# EAGLE design chassis_ctrl (EAGLE 9.6.2)
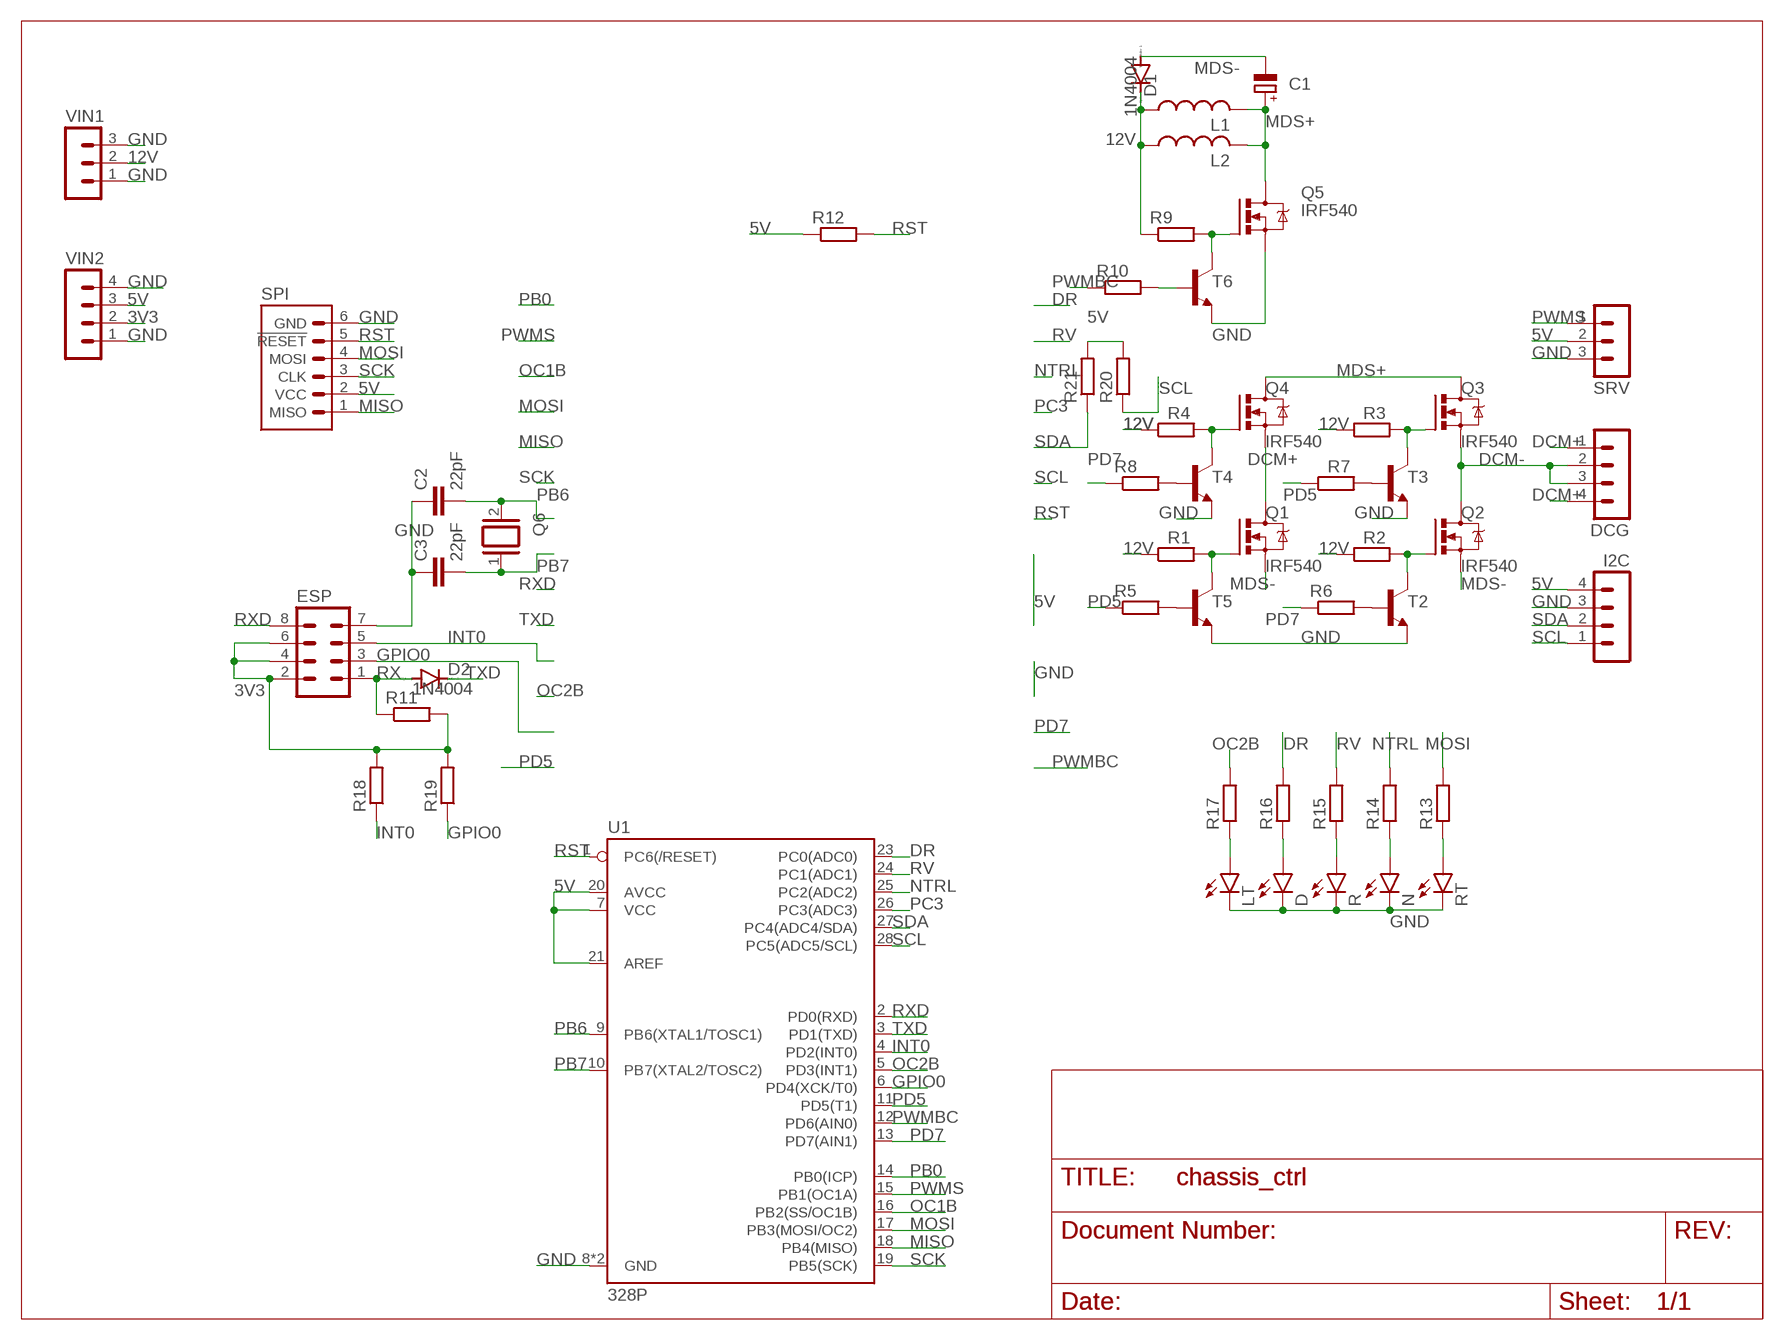
[diagram p0: schematic, sheet 1]

## Parts
C1  CPOL-EUE5-10.5  [E5-10,5]
C2  22pF  22PF-PTH-2.54MM-200V-5%  [CAP-PTH-2.54]
C3  22pF  22PF-PTH-2.54MM-200V-5%  [CAP-PTH-2.54]
D  LED5MM  [LED5MM]
D1  1N4004  [DO41-10]
D2  1N4004  [DO41-10]
DCG  MA04-1  [MA04-1]
ESP  MA04-2  [MA04-2]
I2C  MA04-1  [MA04-1]
L1  L-US0204V  [0204V]
L2  L-US0204V  [0204V]
LT  LED5MM  [LED5MM]
N  LED5MM  [LED5MM]
Q1  IRF540  [TO220BV]
Q2  IRF540  [TO220BV]
Q3  IRF540  [TO220BV]
Q4  IRF540  [TO220BV]
Q5  IRF540  [TO220BV]
Q6  XTAL/S  [QS]
R  LED5MM  [LED5MM]
R1  R-EU_0207/10  [0207/10]
R2  R-EU_0207/10  [0207/10]
R3  R-EU_0207/10  [0207/10]
R4  R-EU_0207/10  [0207/10]
R5  R-EU_0207/10  [0207/10]
R6  R-EU_0207/10  [0207/10]
R7  R-EU_0207/10  [0207/10]
R8  R-EU_0207/10  [0207/10]
R9  R-EU_0207/10  [0207/10]
R10  R-EU_0207/10  [0207/10]
R11  R-EU_0207/10  [0207/10]
R12  R-EU_0207/10  [0207/10]
R13  R-EU_0207/10  [0207/10]
R14  R-EU_0207/10  [0207/10]
R15  R-EU_0207/10  [0207/10]
R16  R-EU_0207/10  [0207/10]
R17  R-EU_0207/10  [0207/10]
R18  R-EU_0207/10  [0207/10]
R19  R-EU_0207/10  [0207/10]
R20  R-EU_0207/10  [0207/10]
R21  R-EU_0207/10  [0207/10]
RT  LED5MM  [LED5MM]
SPI  MISO_MOSITHT_100MIL  [PINHEADER_2R03_100MIL]
SRV  MA03-1  [MA03-1]
T2  2N2222-NPN-TO92-EBC  [TO92-EBC]
T3  2N2222-NPN-TO92-EBC  [TO92-EBC]
T4  2N2222-NPN-TO92-EBC  [TO92-EBC]
T5  2N2222-NPN-TO92-EBC  [TO92-EBC]
T6  2N2222-NPN-TO92-EBC  [TO92-EBC]
U1  328P  ATMEGA328P_PDIP  [DIP28]
VIN1  MA03-1  [MA03-1]
VIN2  MA04-1  [MA04-1]

## Nets
3V3: ESP.2 ESP.4 ESP.6 R11.2 R18.2 R19.2 VIN2.2
5V: I2C.4 R12.1 R20.2 R21.2 SPI.2(VCC) SRV.2 U1.7(VCC) U1.20(AVCC) U1.21(AREF) VIN2.3
12V: D1.C L1.1 L2.1 R1.1 R2.1 R3.1 R4.1 R9.1 VIN1.2
DCM+: DCG.1 DCG.4 Q1.D Q4.S
DCM-: DCG.2 DCG.3 Q2.D Q3.S
DR: R16.2 U1.23(PC0(ADC0))
GND: C2.1 C3.1 D.K(C) ESP.7 I2C.3 LT.K(C) N.K(C) Q5.S R.K(C) RT.K(C) SPI.6(GND) SRV.3 T2.E T3.E T4.E T5.E T6.E U1.8(GND) U1.22(GND) VIN1.1 VIN1.3 VIN2.1 VIN2.4
GPIO0: ESP.3 R19.1 U1.6(PD4(XCK/T0))
INT0: ESP.5 R18.1 U1.4(PD2(INT0))
MDS+: C1.+ L1.2 L2.2 Q3.D Q4.D Q5.D
MDS-: C1.- D1.A Q1.S Q2.S
MISO: SPI.1(MISO) U1.18(PB4(MISO))
MOSI: R13.2 SPI.4(MOSI) U1.17(PB3(MOSI/OC2))
N$1: LT.A R17.1
N$2: D.A R16.1
N$3: R15.1 R.A
N$4: N.A R14.1
N$5: R13.1 RT.A
N$6: Q2.G R2.2 T2.C
N$7: Q1.G R1.2 T5.C
N$8: Q3.G R3.2 T3.C
N$9: Q4.G R4.2 T4.C
N$10: R5.2 T5.B
N$11: R7.2 T3.B
N$12: R6.2 T2.B
N$13: R8.2 T4.B
N$16: Q5.G R9.2 T6.C
N$18: R10.2 T6.B
NTRL: R14.2 U1.25(PC2(ADC2))
OC1B: U1.16(PB2(SS/OC1B))
OC2B: R17.2 U1.5(PD3(INT1))
PB0: U1.14(PB0(ICP))
PB6: C2.2 Q6.2 U1.9(PB6(XTAL1/TOSC1))
PB7: C3.2 Q6.1 U1.10(PB7(XTAL2/TOSC2))
PC3: U1.26(PC3(ADC3))
PD5: R5.1 R7.1 U1.11(PD5(T1))
PD7: R6.1 R8.1 U1.13(PD7(AIN1))
PWMBC: R10.1 U1.12(PD6(AIN0))
PWMS: SRV.1 U1.15(PB1(OC1A))
RST: R12.2 SPI.5(!RESET) U1.1(PC6(/RESET))
RV: R15.2 U1.24(PC1(ADC1))
RX: D2.A ESP.1 R11.1
RXD: ESP.8 U1.2(PD0(RXD))
SCK: SPI.3(CLK) U1.19(PB5(SCK))
SCL: I2C.1 R20.1 U1.28(PC5(ADC5/SCL))
SDA: I2C.2 R21.1 U1.27(PC4(ADC4/SDA))
TXD: D2.C U1.3(PD1(TXD))

## Library data of the parts
C1 = rcl:CPOL-EU: POLARIZED CAPACITOR, European symbol; SPICEPREFIX: C
C2 C3 = SparkFun-Capacitors:22PF: 22pF ceramic capacitors A capacitor is a passive two-terminal electrical component used to store electrical energy temporarily in an electric field.; PROD_ID: CAP-09128
D LT N R RT = led:LED: LED OSRAM: - CHIPLED LG R971, LG N971, LY N971, LG Q971, LY Q971, LO R971, LY R971 LH N974, LH R974 LS Q976, LO Q976, LY Q976 LO Q996 - Hyper CHIPLED LW Q18S LB Q993, LB Q99A, LB R99A - SideLED LS A670, LO A670, LY A670, LG A670, LP A670 LB A673, LV A673, LT A673, LW A673 LH A674 LY A675 LS A676, LA A676, LO A676, LY A676, LW A676 LS A679, LY A679, LG A679 - Hyper Micro SIDELED® LS Y876, LA Y876, LO Y876, LY Y876 LT Y87S - SmartLED LW L88C, LW L88S LB L89C, LB L89S, LG L890 LS L89K, LO L89K, LY L89K LS L896, LA L896, LO L896, LY L896 - TOPLED LS T670, LO T670, LY T670, LG T670, LP T670 LSG T670, LSP T670, LSY T670, LOP T670, LYG T670 LG T671, LOG T671, LSG T671 LB T673, LV T673, LT T673, LW T673 LH T674 LS T676, LA T676, LO T676, LY T676, LB T676, LH T676, LSB T676, LW T676 LB T67C, LV T67C, LT T67C, LS T67K, LO T67K, LY T67K, LW E67C LS E67B, LA E67B, LO E67B, LY E67B, LB E67C, LV E67C, LT E67C LW T67C LS T679, LY T679, LG T679 LS T770, LO T770, LY T770, LG T770, LP T770 LB T773, LV T773, LT T773, LW T773 LH T774 LS E675, LA E675, LY E675, LS T675 LS T776, LA T776, LO T776, LY T776, LB T776 LHGB T686 LT T68C, LB T68C - Hyper Mini TOPLED® LB M676 - Mini TOPLED Santana® LG M470 LS M47K, LO M47K, LY M47K Source: http://www.osram.convergy.de LUXEON: - LUMILED® LXK2-PW12-R00, LXK2-PW12-S00, LXK2-PW14-U00, LXK2-PW14-V00 LXK2-PM12-R00, LXK2-PM12-S00, LXK2-PM14-U00 LXK2-PE12-Q00, LXK2-PE12-R00, LXK2-PE12-S00, LXK2-PE14-T00, LXK2-PE14-U00 LXK2-PB12-K00, LXK2-PB12-L00, LXK2-PB12-M00, LXK2-PB14-N00, LXK2-PB14-P00, LXK2-PB14-Q00 LXK2-PR12-L00, LXK2-PR12-M00, LXK2-PR14-Q00, LXK2-PR14-R00 LXK2-PD12-Q00, LXK2-PD12-R00, LXK2-PD12-S00 LXK2-PH12-R00, LXK2-PH12-S00 LXK2-PL12-P00, LXK2-PL12-Q00, LXK2-PL12-R00 Source: www.luxeon.com KINGBRIGHT: KA-3528ASYC Source: www.kingbright.com
D1 D2 = diode:1N4004: DIODE general purpose rectifier, 1 A
DCG I2C VIN2 = con-lstb:MA04-1: PIN HEADER; OC_FARNELL: unknown; OC_NEWARK: unknown
ESP = con-lstb:MA04-2: PIN HEADER; OC_FARNELL: unknown; OC_NEWARK: unknown
L1 L2 = rcl:L-US: INDUCTOR, American symbol; SPICEPREFIX: L
Q1-Q5 = transistor-power:IRF540: HEXFET Power MOSFET
Q6 = special:XTAL/S: CRYSTAL
R1-R21 = rcl:R-EU_: RESISTOR, European symbol; SPICEPREFIX: R
SPI = atmel:MISO_MOSI: MISO/MOSI Programmer Interface refere to Atmel/Microchip description of pin header style <http://microchipdeveloper.com/atmelice:connecting-atmel-ice-to-a-debugwire-target>; OC_FARNELL: unknown; OC_NEWARK: unknown
SRV VIN1 = con-lstb:MA03-1: PIN HEADER; OC_FARNELL: unknown; OC_NEWARK: unknown
T2-T6 = transistor-neu-to92:*-NPN-: NPN Transistror
U1 = SparkFun-IC-Microcontroller:ATMEGA328P_PDIP: Atmel 328P Through hole ATMEGA328P uC used in the Arduino 32kb flash, 1k EEPROM, 2k SRAM Datasheet <http://www.sparkfun.com/datasheets/Components/SMD/ATMega328.pdf> SparkFun Products Storefront component: AVR 28 Pin 20MHz 32K 6A/D - ATMega328P <https://www.sparkfun.com/products/9061> (COM-09061) SparkFun Simon Says - Through-Hole Soldering Kit <https://www.sparkfun.com/products/10547> (KIT-10547) SparkFun Learn to Solder - Simon Says <https://www.sparkfun.com/products/13708> (KIT-13708) SparkFun BigTime Watch Kit <https://www.sparkfun.com/products/11734> (KIT-11734) SparkFun ClockIt <https://www.sparkfun.com/products/10930> (KIT-10930) SparkFun Serial Enabled LCD Kit <https://www.sparkfun.com/products/10097> (LCD-10097) SparkFun Simon Tilts - Through Hole Soldering Kit <https://www.sparkfun.com/products/12634> (KIT-12634) SparkFun Frequency Counter Kit <https://www.sparkfun.com/products/10140> (KIT-10140) FabFM Radio Kit <https://www.sparkfun.com/products/11043> (KIT-11043) SparkFun Binary Blaster Kit <https://www.sparkfun.com/products/12037> (KIT-12037) SparkFun Metro-Gnome <https://www.sparkfun.com/products/9236> (KIT-09236) ATmega328 with Arduino Optiboot (Uno) <https://www.sparkfun.com/products/10524> (DEV-10524); PROD_ID: IC-09136

## Board
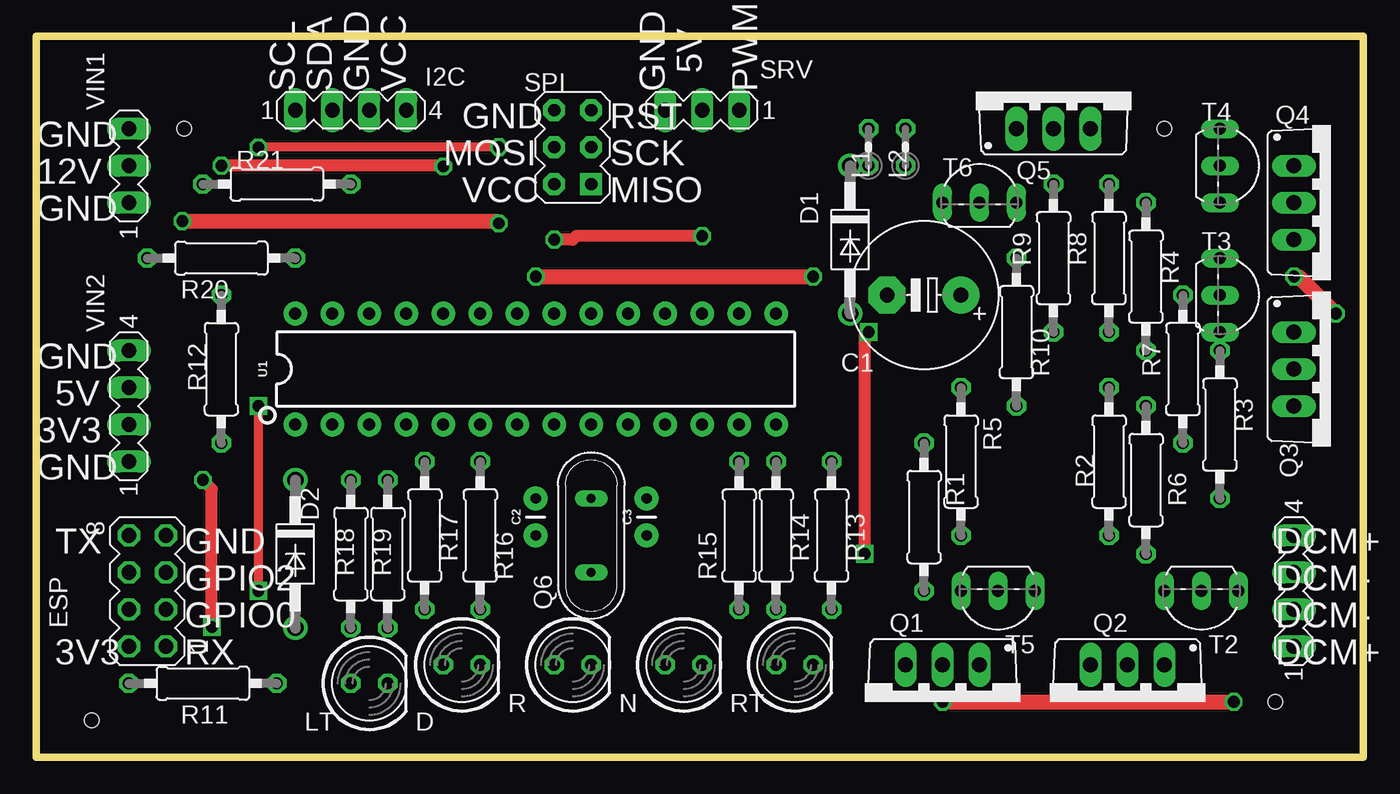
[diagram p1: board, top side]
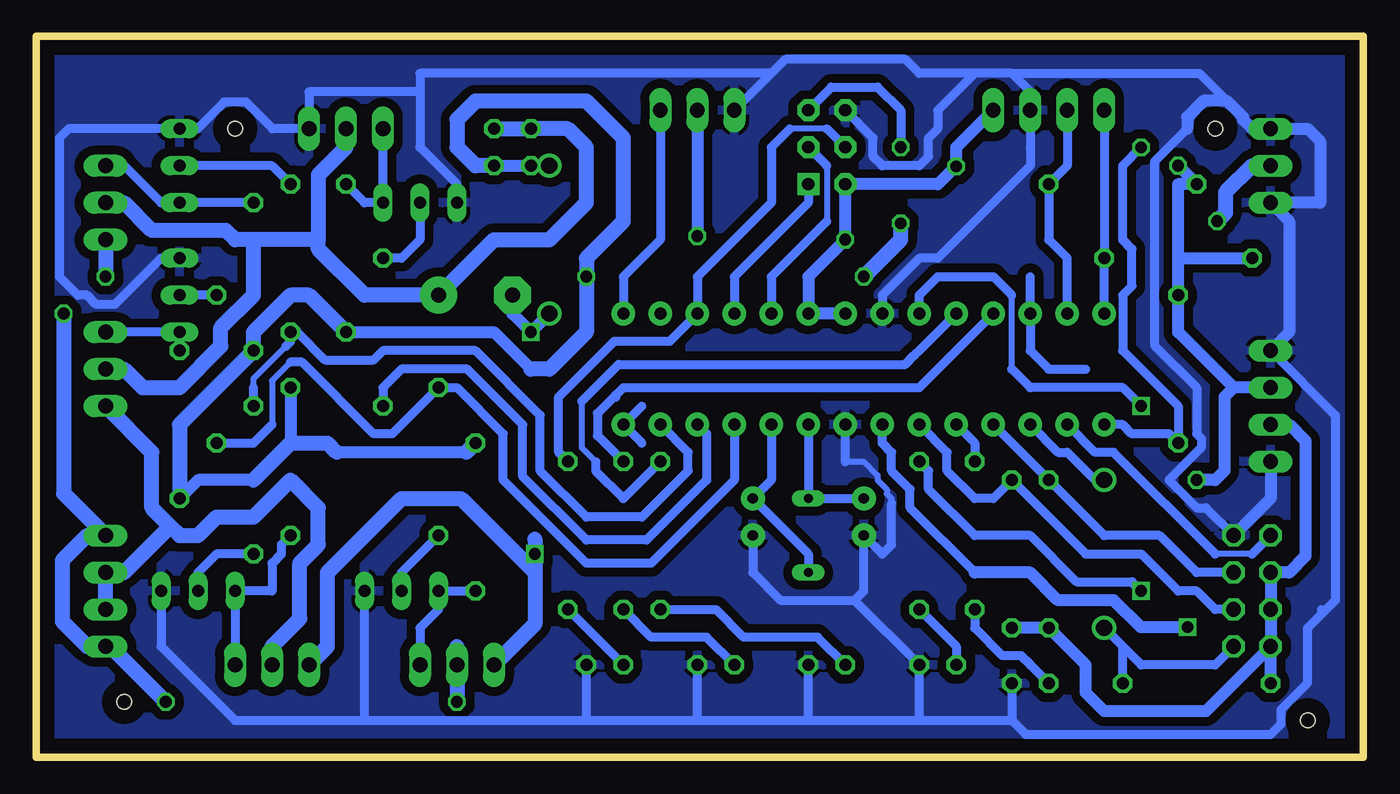
[diagram p2: board, bottom side, seen from below]

Size 91.11 x 49.52 mm. Coordinates in mm from the lower left corner, seen from the top.
Outline: 0,0 91.11,0 91.11,49.52 0,49.52 0,0
Copper layers (1*16): Top 0.035mm / dielectric 1.5mm / Bottom 0.035mm
Design rules "default": minimum track width 6mil, minimum drill 0.35mm, track to track 6mil, track to pad 6mil, pad to pad 6mil, via to via 6mil, smd to smd 6mil, copper to edge 40mil, drill to drill 6mil, minimum pad ring 10mil, minimum via ring 8mil, stop-mask expansion 4mil, vias tented up to drill 0mil, thermal gap 10mil
Holes 1 mm at 85.09,3.81 10.16,43.18 3.81,2.54 77.47,43.18

### Footprints (pad centres in the part's own frame; a part is rotated, then mirrored left to right if it is on the bottom)
E5-10,5 = drill 1.016 pad 2.54: + -2.54,0 | drill 1.016 pad 2.54 octagon: - 2.54,0
CAP-PTH-2.54 = drill 0.7 pad 1.651: 1 -1.27,0; 2 1.27,0
LED5MM = drill 0.813 octagon: A -1.27,0; K 1.27,0
DO41-10 = drill 1.118: A 5.08,0; C -5.08,0
MA04-1 = drill 1.016 long: 1 -3.81,0; 2 -1.27,0; 3 1.27,0; 4 3.81,0
MA04-2 = drill 1.016 octagon: 1 -3.81,-1.27; 2 -3.81,1.27; 3 -1.27,-1.27; 4 -1.27,1.27; 5 1.27,-1.27; 6 1.27,1.27; 7 3.81,-1.27; 8 3.81,1.27
0204V = drill 0.813 octagon: 1 -1.27,0; 2 1.27,0
TO220BV = drill 1.016 long: D 0,-2.54; G -2.54,-2.54; S 2.54,-2.54
QS = drill 0.61 long: 1 -2.54,0; 2 2.54,0
0207/10 = drill 0.813 octagon: 1 -5.08,0; 2 5.08,0
PINHEADER_2R03_100MIL = drill 0.85 pad 1.5 square: 1 -2.54,-1.27 | drill 0.85 pad 1.5 octagon: 2 -2.54,1.27; 3 0,-1.27; 4 0,1.27; 5 2.54,-1.27; 6 2.54,1.27
MA03-1 = drill 1.016 long: 1 -2.54,0; 2 0,0; 3 2.54,0
TO92-EBC = drill 0.813 long: B 0,-1.27; C 2.54,-1.27; E -2.54,-1.27
DIP28 = drill 0.813 pad 1.626: 1 -16.51,-3.81; 2 -13.97,-3.81; 3 -11.43,-3.81; 4 -8.89,-3.81; 5 -6.35,-3.81; 6 -3.81,-3.81; 7 -1.27,-3.81; 8 1.27,-3.81; 9 3.81,-3.81; 10 6.35,-3.81; 11 8.89,-3.81; 12 11.43,-3.81; 13 13.97,-3.81; 14 16.51,-3.81; 15 16.51,3.81; 16 13.97,3.81; 17 11.43,3.81; 18 8.89,3.81; 19 6.35,3.81; 20 3.81,3.81; 21 1.27,3.81; 22 -1.27,3.81; 23 -3.81,3.81; 24 -6.35,3.81; 25 -8.89,3.81; 26 -11.43,3.81; 27 -13.97,3.81; 28 -16.51,3.81

### Placement (x,y rotation side)
C1  60.96,31.75 180 top
C2  34.29,16.51 90 top
C3  41.91,16.51 90 top
D  29.21,6.35 0 top
D1  55.88,35.56 270 top
D2  17.78,13.97 270 top
DCG  86.36,11.43 90 top
ESP  7.62,11.43 90 top
I2C  21.59,44.45 0 top
L1  57.15,41.91 90 top
L2  59.69,41.91 90 top
LT  22.86,5.08 0 top
N  44.45,6.35 0 top
Q1  62.23,3.81 180 top
Q2  74.93,3.81 180 top
Q3  88.9,26.67 270 top
Q4  88.9,38.1 270 top
Q5  69.85,45.72 0 top
Q6  38.1,15.24 90 top
R  36.83,6.35 0 top
R1  60.96,16.51 270 top
R2  73.66,20.32 270 top
R3  81.28,22.86 90 top
R4  76.2,33.02 90 top
R5  63.5,20.32 270 top
R6  76.2,19.05 270 top
R7  78.74,26.67 90 top
R8  73.66,34.29 90 top
R9  69.85,34.29 90 top
R10  67.31,29.21 90 top
R11  11.43,5.08 180 top
R12  12.7,26.67 270 top
R13  54.61,15.24 90 top
R14  50.8,15.24 90 top
R15  48.26,15.24 90 top
R16  30.48,15.24 90 top
R17  26.67,15.24 90 top
R18  21.59,13.97 270 top
R19  24.13,13.97 270 top
R20  12.7,34.29 180 top
R21  16.51,39.37 180 top
RT  52.07,6.35 0 top
SPI  36.83,41.91 90 top
SRV  45.72,44.45 180 top
T2  80.01,10.16 180 top
T3  82.55,31.75 270 top
T4  82.55,40.64 270 top
T5  66.04,10.16 180 top
T6  64.77,39.37 0 top
U1  34.29,26.67 0 top
VIN1  6.35,40.64 90 top
VIN2  6.35,24.13 90 top

### Tracks (layer width: path | path; a pad name or v marks a point on that pad's centre or on a via)
3V3
  Bottom 0.813: R19.2 R18.2 19.05,6.35 19.05,4.45 17.78,3.18 10.8,3.18 ESP.2 | ESP.2 ESP.4 ESP.6 5.08,12.7 3.96,13.82 3.96,21.74 5.08,22.86 VIN2.2 | R11.2 ESP.2
5V  (via drill 0.8)
  Top 0.813: v12.05,8.93 12.05,18.43 v11.43,19.05 | v27.94,40.59 27.89,40.64 v12.7,40.64 | v45.72,35.8 37.07,35.8 36.83,35.56 v35.56,35.56
  Bottom 0.61: 26.67,12.7 31.12,17.15 31.12,18.41 32.38,19.69 32.38,20.95 33.02,21.59 U1.7
  Bottom 0.813: 12.7,34.29 R20.2 | 12.7,34.29 R12.1 12.7,29.21 8.89,25.4 | VIN2.3 8.89,25.4 | 8.89,25.4 9.52,24.77 9.52,19.69 10.16,19.05 v11.43,19.05 | 26.67,12.7 22.86,12.7 20.96,10.8 17.14,10.8 15.28,8.93 v12.05,8.93 | I2C.4 27.94,41.91 v27.94,40.59 27.99,40.59 29.21,39.37 SPI.2 v35.56,35.56 38.1,33.02 U1.20 U1.21 | v12.7,40.64 R21.2 12.7,39.37 12.7,34.29 | SRV.2 v45.72,35.8
12V  (via drill 0.8)
  Top 1.016: v10.02,36.83 31.61,36.83 v31.75,36.69 | v34.29,33.02 v53.34,33.02
  Bottom 0.813: R2.1 73.66,21.59 | L2.1 L1.1 D1.C | 61.6,20.95 70.48,20.95 | 76.2,19.05 80.01,19.05 R3.1 | R9.1 59.69,29.21 57.15,26.67
  Bottom 1.016: 76.2,19.05 73.66,21.59 71.12,21.59 70.48,20.95 | R3.1 81.28,22.86 R4.1 76.2,29.21 73.66,31.75 72.39,31.75 R9.1 | R1.1 61.6,20.95 | L2.1 60.96,40.64 62.23,41.91 62.23,43.82 60.96,45.09 53.34,45.09 50.8,42.54 50.8,36.83 53.34,34.29 v53.34,33.02 53.34,29.21 55.88,26.67 57.15,26.67 | v10.02,36.83 9.45,37.39 9.45,38.81 7.62,40.64 VIN1.2 | v34.29,33.02 31.75,35.56 v31.75,36.69
DCM+  (via drill 0.8)
  Top 1.016: v86.36,33.02 86.7,33.02 v89.24,30.48 | v62.23,3.81 v82.23,3.81
  Bottom 1.016: 62.23,7.62 Q1.D v62.23,3.81 | v82.23,3.81 86.04,7.62 DCG.1 87.63,7.62 89.33,9.32 89.33,13.54 87.63,15.24 DCG.4 89.24,18.12 v89.24,30.48 | Q4.S v86.36,33.02
DCM-
  Bottom 1.016: 81.91,15.88 81.28,15.24 80.01,15.24 78.74,16.51 76.2,16.51 73.66,19.05 71.75,17.15 71.75,14.61 73.02,13.34 73.02,9.52 74.93,7.62 Q2.D | 81.91,15.88 83.18,17.15 83.18,20.95 Q3.S | DCG.2 DCG.3 85.09,12.7 81.91,15.88
DR  (via drill 0.8)
  Top 0.61: v15.24,24.13 v15.24,11.43
  Bottom 0.406: 24.13,26.67 24.13,31.75
  Bottom 0.61: 24.13,26.67 22.86,25.4 16.51,25.4 v15.24,24.13 | v15.24,11.43 15.88,12.06 19.69,12.06 22.86,15.24 26.67,15.24 29.84,18.41 29.84,19.69 R16.2 | U1.23 30.48,31.75 29.21,33.02 25.4,33.02 24.13,31.75
GND
  Bottom 0.406: 35.56,20.32 34.29,20.32 33.34,19.37 33.34,19.05 32.7,18.41 32.7,18.1 32.38,17.78 32.38,17.42
  Bottom 0.61: 12.08,43.18 14.3,40.97 14.3,28.27 11.43,25.4 11.43,22.23 11.11,21.91 11.11,21.27 13.34,19.05 11.43,17.15 10.8,17.15 ESP.7 | 22.86,43.18 I2C.3 | I2C.3 22.86,45.72 24.13,46.99 | 24.13,46.99 26.67,46.99 | 26.67,46.99 29.21,44.45 29.21,43.18 29.84,42.54 29.84,41.27 30.48,40.64 33.02,40.64 33.66,41.27 33.66,42.54 SPI.6 | 26.67,46.99 30.48,46.99 31.44,47.95 39.69,47.95 40.64,46.99 | 40.64,46.99 SRV.3 | 24.13,46.99 11.25,46.99 9.36,45.1 | 40.64,46.99 64.77,46.99 64.77,45.72 | 64.77,45.72 64.77,41.91 62.23,39.37 T6.E | 64.77,45.72 72.39,45.72 Q5.S 74.89,43.18 76.72,45 78.22,45 80.04,43.18 T4.E 88.9,43.18 89.53,42.54 89.53,33.02 88.27,31.75 87.63,31.75 86.99,31.12 85.72,31.12 82.55,34.29 T3.E | 35.56,20.32 U1.8 | C3.1 41.91,12.7 40.01,10.8 34.93,10.8 | 34.93,10.8 34.29,11.43 C2.1 33.02,13.97 32.38,14.61 32.38,17.42 | T2.E 82.55,7.62 77.47,2.54 68.58,2.54 | 68.58,2.54 T5.E | 68.58,2.54 53.34,2.54 | 53.34,2.54 RT.K | 53.34,2.54 45.72,2.54 | 45.72,2.54 N.K | 45.72,2.54 38.1,2.54 | 38.1,2.54 R.K | 38.1,2.54 30.48,2.54 | 30.48,2.54 D.K 34.93,10.8 | 30.48,2.54 24.13,2.54 | LT.K 24.13,2.54 | 24.13,2.54 23.16,1.58 6.35,1.58 5.63,2.29 5.63,3.29 3.81,5.12 3.81,8.89 2.84,9.86 | 2.84,9.86 2.84,10.16 | 2.84,9.86 1.91,10.8 1.91,23.49 VIN2.4 | I2C.3 22.86,41.91 | I2C.3 22.86,40.64 29.21,34.29 30.48,34.29 33.02,31.75 U1.22
  Bottom 0.813: VIN2.4 5.08,29.21 5.08,36.83 VIN1.1 2.95,38.1 2.95,42.32 3.81,43.18 VIN1.3 7.62,43.18 8.24,43.8 8.24,43.98 9.36,45.1 10.96,45.1 12.08,43.98 12.08,43.18 | VIN2.1 6.35,17.78 ESP.7
  pour Bottom (isolate 0.61): 0,49.53 91.44,49.53 91.44,1.27 91.44,0 0,0
GPIO0
  Bottom 0.61: U1.6 28.57,20.95 28.57,19.69 26.67,17.78 25.4,17.78 R19.1 19.05,13.97 15.24,13.97 12.7,11.43 11.43,11.43 10.16,10.16 ESP.3
INT0
  Bottom 0.61: ESP.5 11.43,12.7 13.97,15.24 17.78,15.24 R18.1 U1.4
MDS+
  Bottom 1.016: L2.2 L1.2 54.61,43.18 53.34,41.91 53.34,38.1 55.88,35.56 59.69,35.56 C1.+ 68.58,31.75 71.75,34.93 71.75,35.56 | Q5.D 69.85,41.91 71.75,40.01 71.75,35.56 | Q4.D 85.09,38.1 83.18,36.2 78.1,36.2 77.47,35.56 76.2,35.56 | 71.75,35.56 76.2,35.56 | Q3.D 85.09,26.67 83.82,25.4 81.28,25.4 78.44,28.24 78.44,29.51 76.2,31.75 76.2,35.56
MDS-  (via drill 0.8)
  Top 0.813: v57.15,29.21 56.88,28.94 v56.88,13.97
  Bottom 0.813: C1.- 58.42,30.48 v57.15,29.21 D1.A
  Bottom 1.016: Q1.S 56.88,9.16 56.88,12.7 | 56.88,14.97 v56.88,13.97 56.88,12.7 | Q2.S 71.12,7.62 71.12,12.7 66.04,17.78 61.96,17.78 56.88,12.7
MISO
  Bottom 0.61: U1.18 43.18,33.02 38.1,38.1 SPI.1
MOSI
  Bottom 0.406: 36.83,43.18 39.37,43.18
  Bottom 0.61: R13.2 55.24,20.95 55.24,24.77 51.44,28.58 47.62,28.58 U1.17 45.72,33.02 40.64,38.1 40.64,41.91 39.37,43.18 | SPI.4 36.83,43.18
N$1
  Bottom 0.61: R17.1 26.67,8.89 24.77,6.98 23.5,6.98 22.86,6.35 LT.A
N$2
  Bottom 0.61: R16.1 27.94,7.62 D.A
N$3
  Bottom 0.61: R15.1 44.45,10.16 42.55,8.26 37.47,8.26 R.A
N$4
  Bottom 0.61: R14.1 48.9,8.26 45.09,8.26 N.A
N$5
  Bottom 0.61: R13.1 RT.A
N$6
  Bottom 0.61: Q2.G T2.C 74.93,11.43 74.93,13.34 74.29,13.97 74.29,14.61 R2.2
N$7
  Bottom 0.61: R1.2 T5.C 63.5,10.16 64.77,8.89 Q1.G
N$8
  Bottom 0.61: Q3.G T3.C R3.2
N$9
  Bottom 0.61: R4.2 T4.C 82.55,38.1 85.09,40.64 Q4.G
N$10
  Bottom 0.61: R5.2 66.04,12.7 T5.B
N$11
  Bottom 0.61: R7.2 T3.B
N$12
  Bottom 0.61: R6.2 78.74,13.97 80.01,12.7 T2.B
N$13
  Bottom 0.61: R8.2 74.93,40.64 T4.B
N$16
  Bottom 0.61: Q5.G T6.C 68.58,38.1 R9.2
N$18
  Bottom 0.61: T6.B 64.77,35.56 66.04,34.29 R10.2
NTRL
  Bottom 0.61: 51.31,24.74 51.31,24.89 | 51.31,24.89 50.8,25.4 30.48,25.4 U1.25 | R14.2 52.58,22.1 52.58,23.62 51.31,24.89
OC2B
  Bottom 0.61: U1.5 26.67,21.59 R17.2
PB0
  Bottom 0.61: 49.53,21.59 U1.14 49.53,24.13
PB6
  Bottom 0.61: U1.9 Q6.2 C2.2
PB7
  Bottom 0.61: U1.10 40.64,19.05 C3.2 38.1,13.97 Q6.1
PC3
  Bottom 0.61: 19.05,26.67 21.59,26.67 22.86,27.94 U1.26 22.86,33.02
PD5
  Bottom 0.406: 73.66,27.15 74.93,25.88 74.93,22.86
  Bottom 0.61: R7.1 76.2,21.59 74.93,22.86 | U1.11 43.18,19.05 48.9,13.34 53.34,13.34 59.05,19.05 59.05,22.23 62.23,25.4 R5.1 66.67,22.23 67.94,22.23 72.87,27.15 73.66,27.15
PD7
  Bottom 0.406: 76.2,25.4 76.2,26.02 73.97,28.25
  Bottom 0.61: U1.13 46.36,20.95 46.36,19.69 49.53,16.51 53.34,16.51 56.52,19.69 56.52,23.49 60.96,27.94 67.31,27.94 67.94,27.3 71.31,27.3 73.22,29.21 R8.1 73.66,28.56 73.97,28.25 | R6.1 76.2,25.4
PWMBC
  Bottom 0.61: U1.12 45.09,22.23 45.09,19.05 49.21,14.92 53.34,14.92 57.72,19.3 57.72,22.86 61.53,26.67 66.04,26.67 67.31,25.4 R10.1
PWMS
  Bottom 0.61: U1.15 50.8,33.02 48.26,35.56 SRV.1
RST  (via drill 0.8)
  Top 0.61: v31.75,41.91 31.74,41.9 v15.24,41.9
  Bottom 0.61: U1.1 16.51,22.86 15.88,22.23 13.34,22.23 R12.2 12.7,24.13 16.51,27.94 16.51,31.75 15.88,32.38 15.88,34.93 16.51,35.56 16.51,40.64 15.25,41.9 v15.24,41.9 | SPI.5 36.51,46.04 33.34,46.04 31.75,44.45 v31.75,41.91
RV
  Bottom 0.406: 52.7,20.32 53.66,21.27 53.66,24.45
  Bottom 0.61: R15.2 50.8,17.78 52.7,19.69 52.7,20.32 | U1.24 30.48,27.94 30.8,27.62 31.43,26.99 51.12,26.99 53.66,24.45
RX
  Bottom 0.61: 16.51,7.62 D2.A | R11.1 16.51,7.62 | ESP.1 10.16,6.35 15.24,6.35 16.51,7.62
RXD
  Bottom 0.406: 7.62,13.97 10.16,13.97
  Bottom 0.61: U1.2 18.41,20.95 17.14,20.95 10.16,13.97 | ESP.8 7.62,13.97
SCK
  Bottom 0.406: 36.83,40.64 36.83,36.83
  Bottom 0.61: SPI.3 36.83,40.64 | 36.83,36.83 40.64,33.02 U1.19
SCL
  Bottom 0.61: I2C.1 R20.1 U1.28
SDA
  Bottom 0.61: I2C.2 20.32,40.64 R21.1 21.59,35.56 20.32,34.29 U1.27
TXD
  Bottom 0.61: U1.3 20.96,20.95 20.32,20.95 18.41,19.05 D2.C

### Text on the board
tSilk: 5V | SCL | SDA | GND | VCC | GND | PWM | GND | RST | GND | MOSI | SCK | 12V | VCC | MISO | GND | GND | 5V | 3V3 | GND | TX | GND | DCM+ | GPIO2 | DCM- | GPIO0 | DCM- | 3V3 | RX | DCM+